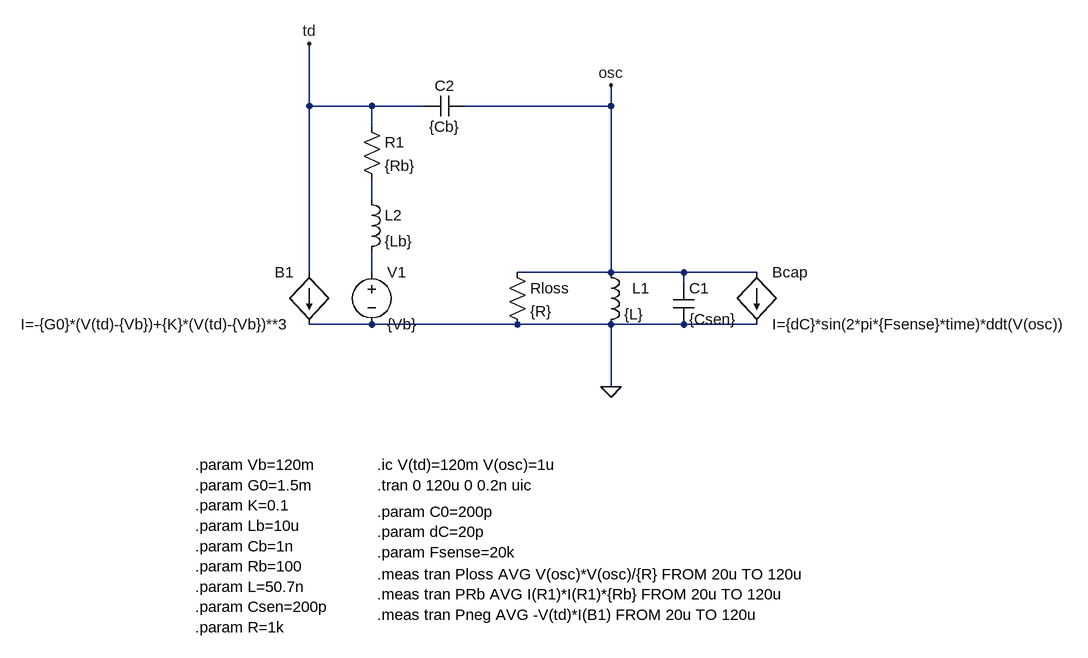
[diagram p0: schematic tdo_sensor_oscillator.asc]
tdo_sensor_oscillator.asc, the LTspice schematic file:
Version 4.1
SHEET 1 880 680
WIRE -672 -208 -672 -304
WIRE -576 -208 -672 -208
WIRE -496 -208 -576 -208
WIRE -208 -208 -208 -240
WIRE -208 -208 -432 -208
WIRE -576 -176 -576 -208
WIRE -576 -64 -576 -96
WIRE -672 48 -672 -208
WIRE -576 48 -576 16
WIRE -208 48 -208 -208
WIRE -208 48 -352 48
WIRE -96 48 -208 48
WIRE 16 48 -96 48
WIRE -96 64 -96 48
WIRE -576 128 -672 128
WIRE -352 128 -576 128
WIRE -208 128 -352 128
WIRE -96 128 -208 128
WIRE 16 128 -96 128
WIRE -208 224 -208 128
FLAG -208 -240 osc
FLAG -208 224 0
FLAG -672 -304 td
SYMBOL res -368 32 R0
SYMATTR InstName Rloss
SYMATTR Value {R}
SYMBOL ind -224 32 R0
WINDOW 0 49 40 Left 2
SYMATTR InstName L1
SYMATTR Value {L}
SYMBOL bi -672 48 M0
SYMATTR InstName B1
SYMATTR Value I=-{G0}*(V(td)-{Vb})+{K}*(V(td)-{Vb})**3
SYMBOL voltage -576 32 R0
WINDOW 123 0 0 Left 0
WINDOW 39 0 0 Left 0
SYMATTR InstName V1
SYMATTR Value {Vb}
SYMBOL ind -592 -80 R0
SYMATTR InstName L2
SYMATTR Value {Lb}
SYMBOL cap -432 -224 R90
WINDOW 0 0 32 VBottom 2
WINDOW 3 32 32 VTop 2
SYMATTR InstName C2
SYMATTR Value {Cb}
SYMBOL res -592 -192 R0
SYMATTR InstName R1
SYMATTR Value {Rb}
SYMBOL bi 16 48 R0
SYMATTR InstName Bcap
SYMATTR Value I={dC}*sin(2*pi*{Fsense}*time)*ddt(V(osc))
SYMBOL cap -112 64 R0
SYMATTR InstName C1
SYMATTR Value {Csen}
TEXT -848 344 Left 2 !.param Vb=120m\n.param G0=1.5m\n.param K=0.1\n.param Lb=10u\n.param Cb=1n\n.param Rb=100\n.param L=50.7n\n.param Csen=200p\n.param R=1k
TEXT -568 344 Left 2 !.ic V(td)=120m V(osc)=1u\n.tran 0 120u 0 0.2n uic
TEXT -568 416 Left 2 !.param C0=200p\n.param dC=20p\n.param Fsense=20k
TEXT -568 512 Left 2 !.meas tran Ploss AVG V(osc)*V(osc)/{R} FROM 20u TO 120u\n.meas tran PRb AVG I(R1)*I(R1)*{Rb} FROM 20u TO 120u\n.meas tran Pneg AVG -V(td)*I(B1) FROM 20u TO 120u

The netlist it stands for:
* tdo_sensor_oscillator.asc
Rloss osc 0 {R}
L1 osc 0 {L}
B1 td 0 I=-{G0}*(V(td)-{Vb})+{K}*(V(td)-{Vb})**3
V1 N002 0 {Vb}
L2 N001 N002 {Lb}
C2 osc td {Cb}
R1 td N001 {Rb}
Bcap osc 0 I={dC}*sin(2*pi*{Fsense}*time)*ddt(V(osc))
C1 osc 0 {Csen}
.param Vb=120m
.param G0=1.5m
.param K=0.1
.param Lb=10u
.param Cb=1n
.param Rb=100
.param L=50.7n
.param Csen=200p
.param R=1k
.ic V(td)=120m V(osc)=1u
.tran 0 120u 0 0.2n uic
.param C0=200p
.param dC=20p
.param Fsense=20k
.meas tran Ploss AVG V(osc)*V(osc)/{R} FROM 20u TO 120u
.meas tran PRb AVG I(R1)*I(R1)*{Rb} FROM 20u TO 120u
.meas tran Pneg AVG -V(td)*I(B1) FROM 20u TO 120u
.backanno
.end